# EAGLE schematic base (EAGLE 7.7.0)
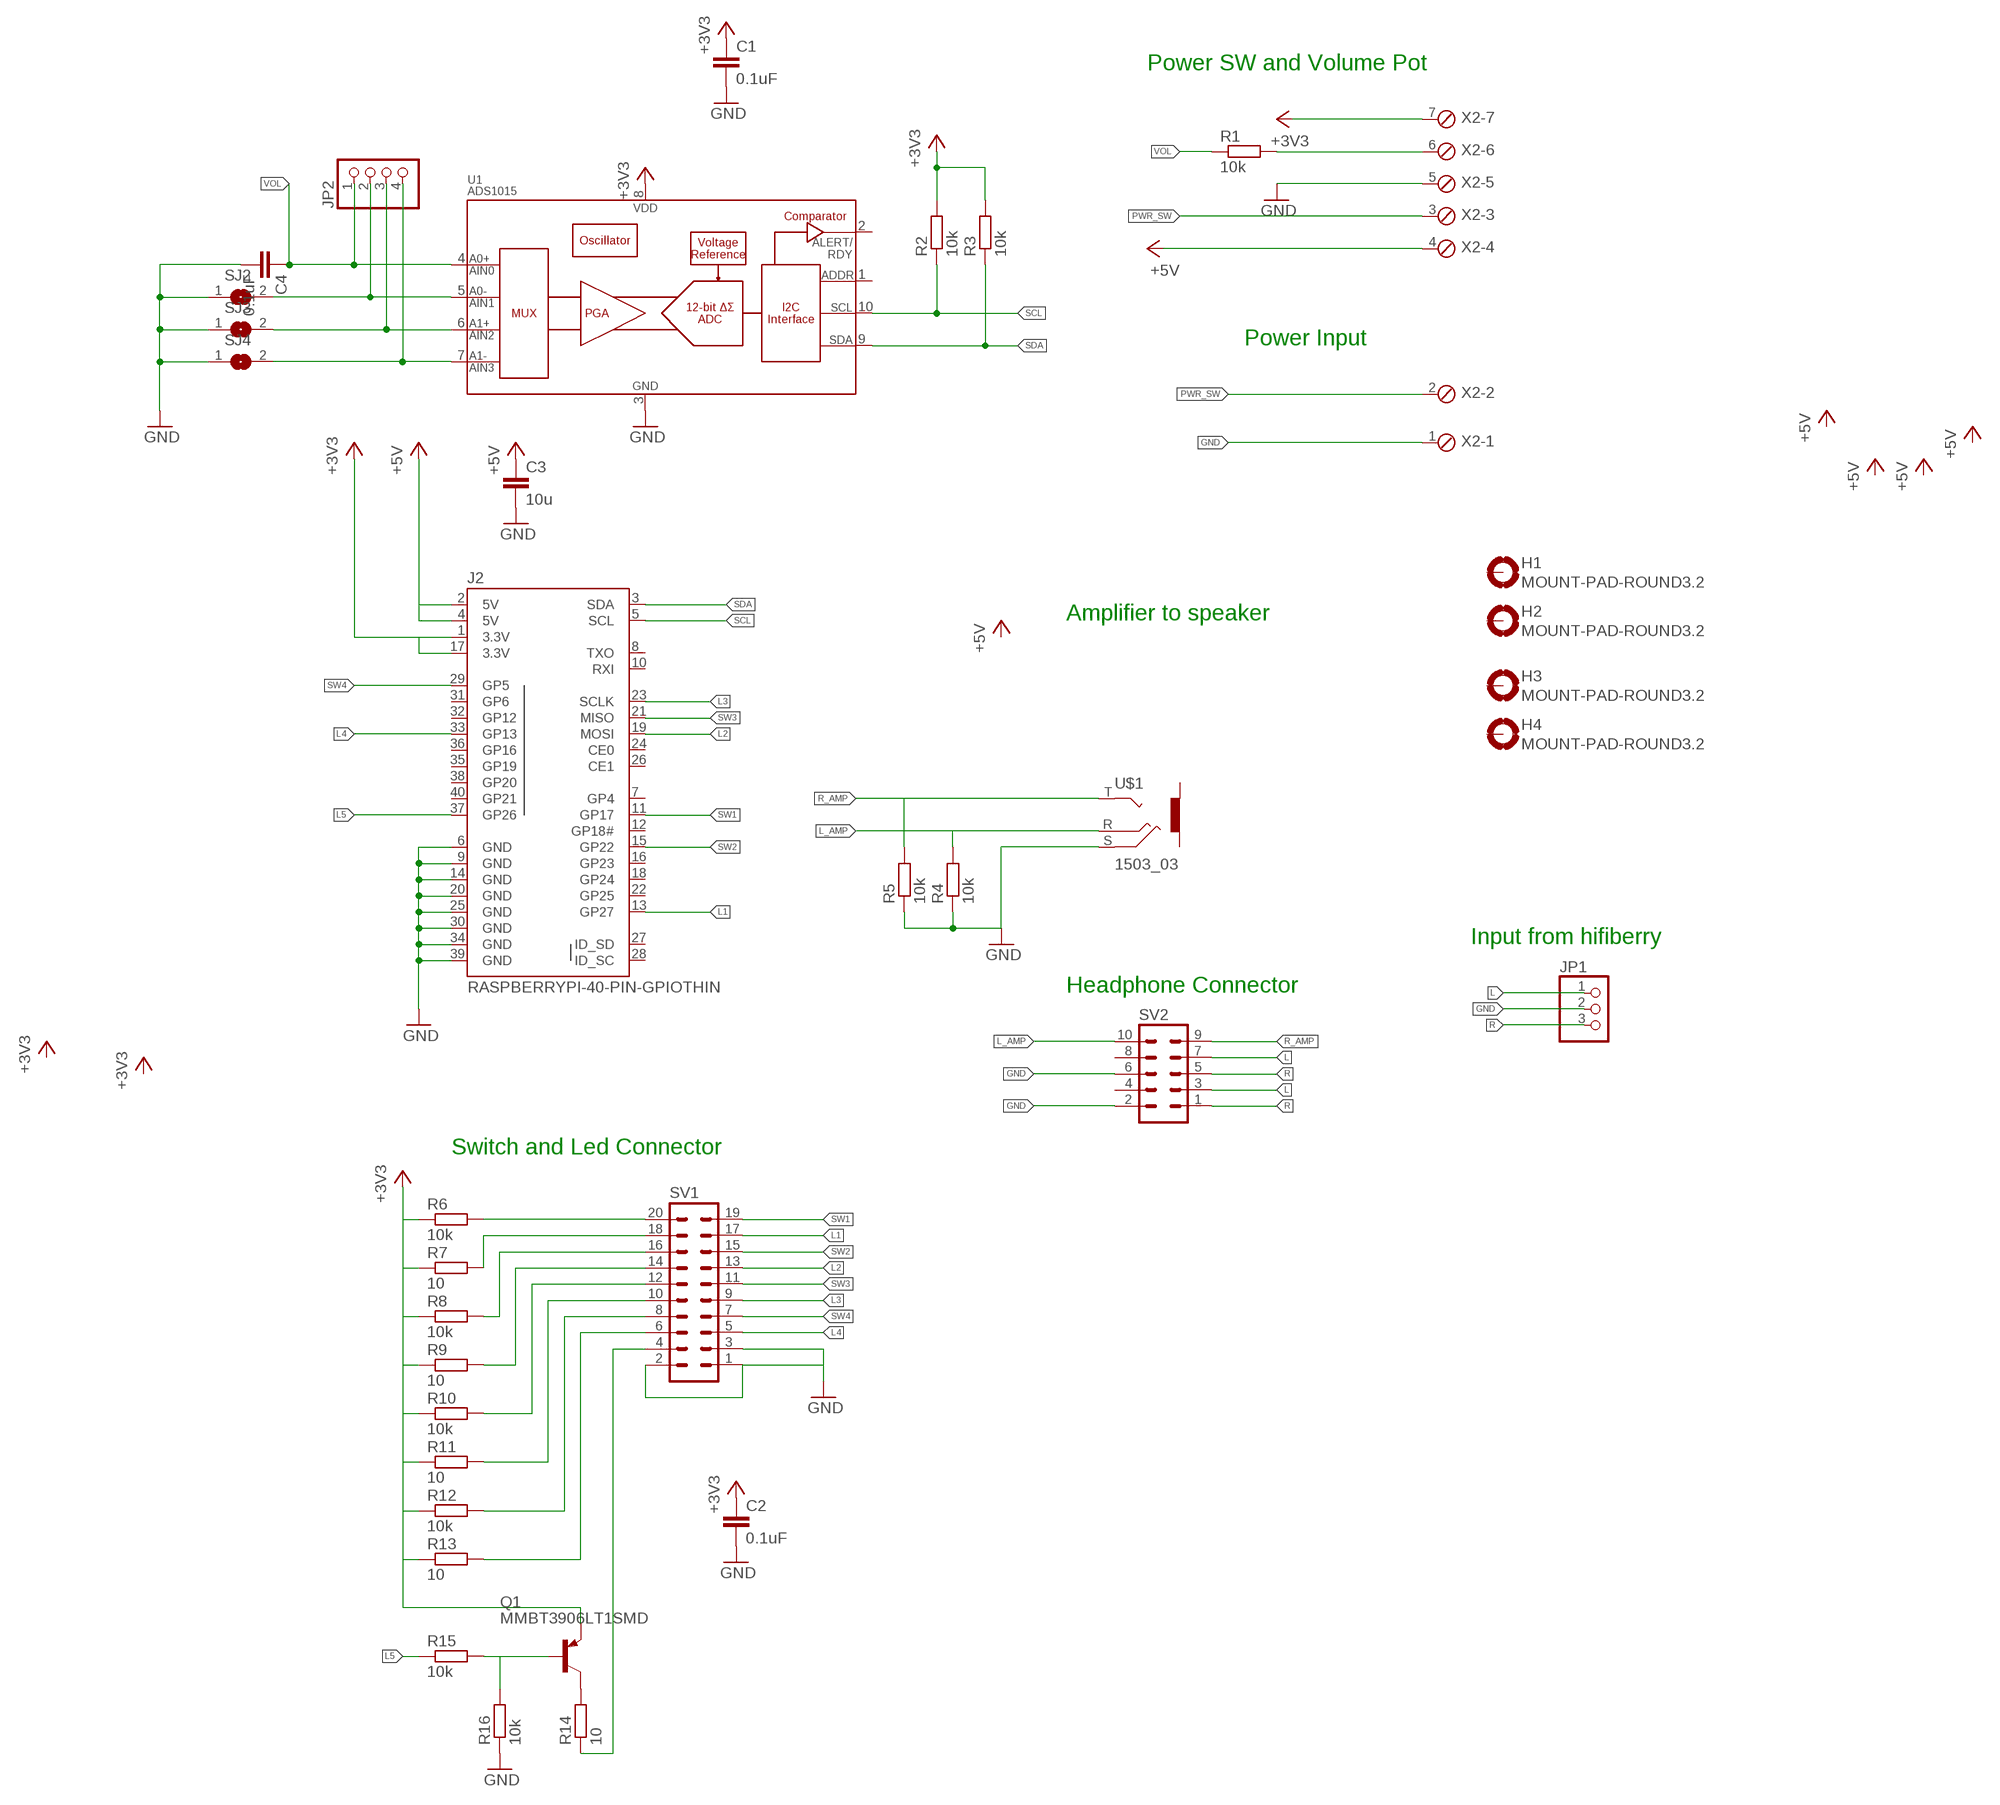
[diagram p0: schematic, sheet 1]

## Parts
C1  0.1uF  C-EUC0805  [C0805]
C2  0.1uF  C-EUC0805  [C0805]
C3  10u  C-EUC0805  [C0805]
C4  0.1uF  C-EUC0805  [C0805]
H1  MOUNT-PAD-ROUND3.2  [3,2-PAD]
H2  MOUNT-PAD-ROUND3.2  [3,2-PAD]
H3  MOUNT-PAD-ROUND3.2  [3,2-PAD]
H4  MOUNT-PAD-ROUND3.2  [3,2-PAD]
J2  RASPBERRYPI-40-PIN-GPIOTHIN  [2X20-SHROUDED-THIN]
JP1  PINHD-1X3  [1X03]
JP2  PINHD-1X4  [1X04]
Q1  MMBT3906LT1SMD  [SOT23-BEC]
R1  10k  R-EU_R0805  [R0805]
R2  10k  R-EU_R0805  [R0805]
R3  10k  R-EU_R0805  [R0805]
R4  10k  R-EU_R0805  [R0805]
R5  10k  R-EU_R0805  [R0805]
R6  10k  R-EU_R0805  [R0805]
R7  10  R-EU_R0805  [R0805]
R8  10k  R-EU_R0805  [R0805]
R9  10  R-EU_R0805  [R0805]
R10  10k  R-EU_R0805  [R0805]
R11  10  R-EU_R0805  [R0805]
R12  10k  R-EU_R0805  [R0805]
R13  10  R-EU_R0805  [R0805]
R14  10  R-EU_R0805  [R0805]
R15  10k  R-EU_R0805  [R0805]
R16  10k  R-EU_R0805  [R0805]
SJ2  SOLDERJUMPER  [SOLDERJUMPER_ARROW_NOPASTE]
SJ3  SOLDERJUMPER  [SOLDERJUMPER_ARROW_NOPASTE]
SJ4  SOLDERJUMPER  [SOLDERJUMPER_ARROW_NOPASTE]
SV1  ML20  [ML20]
SV2  ML10  [ML10]
U1  ADS1015  [MSOP10]
U$1  1503_03  [1503_03]
X2  MPT7  [7POL254]

## Nets
+3V3: C1.1 C2.1 J2.1(3.3V) J2.17(3.3V) Q1.E R2.2 R3.2 R6.1 R7.1 R8.1 R9.1 R10.1 R11.1 R12.1 R13.1 U1.8(VDD) X2.7
+5V: C3.1 J2.2(5V) J2.4(5V) X2.4
GND: C1.2 C2.2 C3.2 C4.2 J2.6(GND) J2.9(GND) J2.14(GND) J2.20(GND) J2.25(GND) J2.30(GND) J2.34(GND) J2.39(GND) JP1.2 R4.1 R5.1 R16.1 SJ2.1 SJ3.1 SJ4.1 SV1.1 SV1.2 SV1.3 SV2.2 SV2.6 U1.3(VSS) U$1.S X2.1 X2.5
L: JP1.1 SV2.3 SV2.7
L1: J2.13(GP27) SV1.17
L2: J2.19(MOSI) SV1.13
L3: J2.23(SCLK) SV1.9
L4: J2.33(GP13) SV1.5
L5: J2.37(GP26) R15.1
L_AMP: R4.2 SV2.10 U$1.R
N$1: Q1.C R14.2
N$2: Q1.B R15.2 R16.2
N$3: R8.2 SV1.16
N$4: R9.2 SV1.14
N$5: R6.2 SV1.20
N$6: R7.2 SV1.18
N$7: R10.2 SV1.12
N$8: JP2.2 SJ2.2 U1.5(AIN1)
N$9: R1.2 X2.6
N$10: R11.2 SV1.10
N$11: JP2.3 SJ3.2 U1.6(AIN2)
N$12: JP2.4 SJ4.2 U1.7(AIN3)
N$13: R12.2 SV1.8
N$14: R13.2 SV1.6
N$15: R14.1 SV1.4
PWR_SW: X2.2 X2.3
R: JP1.3 SV2.1 SV2.5
R_AMP: R5.2 SV2.9 U$1.T
SCL: J2.5(SCL) R2.1 U1.10(SCL)
SDA: J2.3(SDA) R3.1 U1.9(SDA)
SW1: J2.11(GP17) SV1.19
SW2: J2.15(GP22) SV1.15
SW3: J2.21(MISO) SV1.11
SW4: J2.29(GP5) SV1.7
VOL: C4.1 JP2.1 R1.1 U1.4(AIN0)
Unconnected: H1.B3,2(MOUNT) H2.B3,2(MOUNT) H3.B3,2(MOUNT) H4.B3,2(MOUNT) J2.7(GP4) J2.8(TXO) J2.10(RXI) J2.12(GP18#) J2.16(GP23) J2.18(GP24) J2.22(GP25) J2.24(CE0) J2.26(CE1) J2.27(ID_SD) J2.28(ID_SC) J2.31(GP6) J2.32(GP12) J2.35(GP19) J2.36(GP16) J2.38(GP20) J2.40(GP21) SV2.4 SV2.8 U1.1(ADDR) U1.2(ALERT/RDY) U$1.F1 U$1.F2

## Notes on the sheet
- Power SW and Volume Pot
- Power Input
- Amplifier to speaker
- Input from hifiberry
- Headphone Connector
- Switch and Led Connector

## Library data of the parts
C1-C4 = rcl:C-EU: CAPACITOR, European symbol
H1-H4 = holes:MOUNT-PAD-ROUND: MOUNTING PAD, round
J2 = SparkFun-Boards:RASPBERRYPI-40-PIN-GPIO: Second Generation Raspberry Pi GPIO Header 2x20 pin connector, as found on B, B+, A+ models.
JP1 = pinhead:PINHD-1X3: PIN HEADER
JP2 = pinhead:PINHD-1X4: PIN HEADER
Q1 = transistor-pnp:MMBT3906*: PNP Transistror
R1-R16 = resistor:R-EU_: RESISTOR, European symbol
SJ2-SJ4 = microbuilder:SOLDERJUMPER: SMD Solder JUMPER Solder the two pads together to create a connection, or remove the solder to break it. REFLOW - Use this footprint for solder paste and reflow ovens. WAVE - Use this footprint for hand-soldering (larger pads). CLOSED - Has a trace between the two pads to ensure it is closed by default. The trace needs to be cut to disable the jumper, and can be closed again by creating a solder bridge between the two pads.; BOM: EXCLUDE
SV1 = con-ml:ML20: HARTING; OC_FARNELL: unknown; OC_NEWARK: unknown
SV2 = con-ml:ML10: HARTING; OC_FARNELL: unknown; OC_NEWARK: unknown
U1 = SparkFun-AnalogIC:ADS1015: 12-Bit Del-Sig ADC Four single-ended inputs or two differential inputs Internal PGA I2C interface 2.0-5.5V; PROD_ID: IC-12239
U$1 = con-lumberg:1503_03
X2 = con-phoenix-254:MPT7: PHOENIX CONNECTOR; OC_FARNELL: unknown; OC_NEWARK: unknown